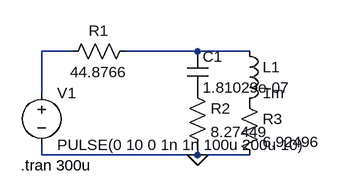
[diagram p0: schematic transitorio_84.asc]
transitorio_84.asc, the LTspice schematic file:
Version 4.1
SHEET 1 880 680
WIRE 64 64 16 64
WIRE 256 64 144 64
WIRE 336 64 256 64
WIRE 16 128 16 64
WIRE 16 224 16 208
WIRE 256 224 256 208
WIRE 256 224 16 224
WIRE 336 224 256 224
FLAG 256 224 0
SYMBOL voltage 16 112 R0
WINDOW 123 0 0 Left 0
WINDOW 39 0 0 Left 0
SYMATTR InstName V1
SYMATTR Value PULSE(0 10 0 1n 1n 100u 200u 10)
SYMBOL res 160 48 R90
WINDOW 0 0 56 VBottom 2
WINDOW 3 32 56 VTop 2
SYMATTR InstName R1
SYMATTR Value 44.8766
SYMBOL cap 240 64 R0
SYMATTR InstName C1
SYMATTR Value 1.81029e-07
SYMBOL res 240 112 R0
SYMATTR InstName R2
SYMATTR Value 8.27449
SYMBOL ind 320 48 R0
SYMATTR InstName L1
SYMATTR Value 1m
SYMATTR SpiceLine Rser=14
SYMBOL res 320 128 R0
SYMATTR InstName R3
SYMATTR Value 6.92496
TEXT -16 240 Left 2 !.tran 300u

The netlist it stands for:
* transitorio_84.asc
V1 N001 0 PULSE(0 10 0 1n 1n 100u 200u 10)
R1 N002 N001 44.8766
C1 N002 P001 1.81029e-07
R2 P001 0 8.27449
L1 N002 P002 1m Rser=14
R3 P002 0 6.92496
.tran 300u
.backanno
.end